# EAGLE schematic sensordrohm (EAGLE 6.2)
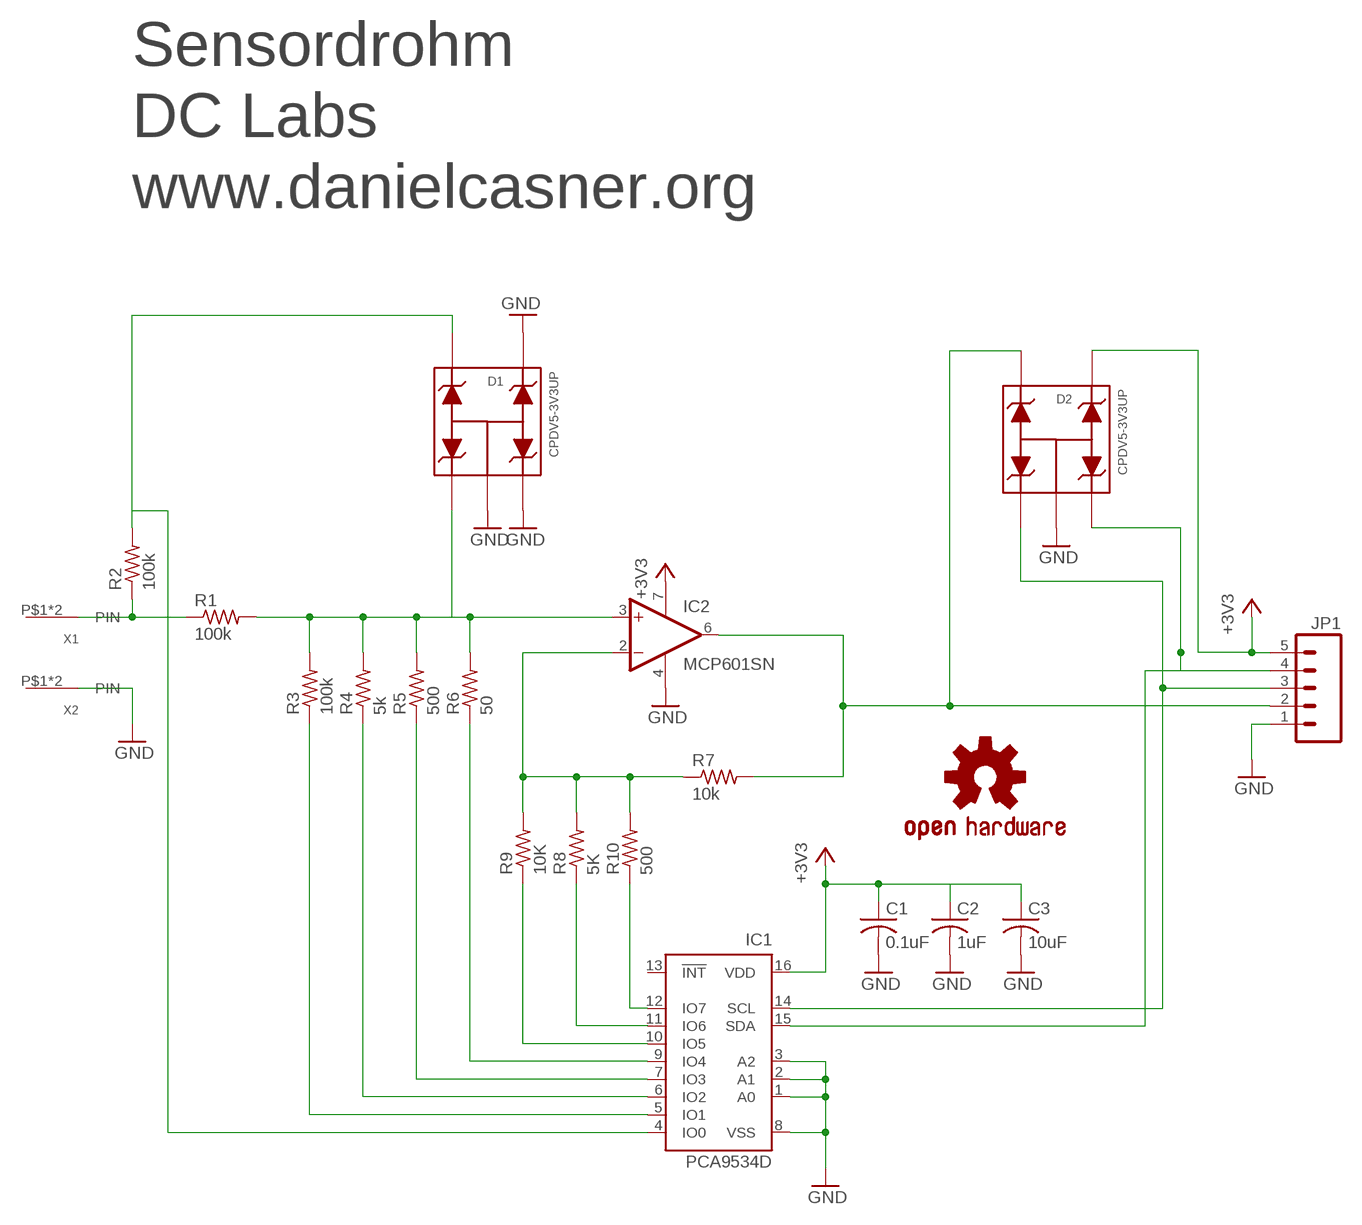
[diagram p0: schematic, sheet 1]

## Parts
C1  0.1uF  C-USC0805  [C0805]
C2  1uF  C-USC0805  [C0805]
C3  10uF  C-USC0805  [C0805]
D1  CPDV5-3V3UP  CPDV5  [SOT353]
D2  CPDV5-3V3UP  CPDV5  [SOT353]
IC1  PCA9534D  [SO16W]
IC2  MCP601SN  [SO08]
JP1  M05PTH_LONGPADS  [1X05_LONGPADS]
R1  100k  R-US_R0402  [R0402]
R2  100k  R-US_R0402  [R0402]
R3  100k  R-US_R0402  [R0402]
R4  5k  R-US_R0402  [R0402]
R5  500  R-US_R0402  [R0402]
R6  50  R-US_R0402  [R0402]
R7  10k  R-US_R0402  [R0402]
R8  5K  R-US_R0402  [R0402]
R9  10K  R-US_R0402  [R0402]
R10  500  R-US_R0402  [R0402]
U$1  OSHW-LOGOS  [OSHW-LOGO-S]
X1  606X  [606X]
X2  606X  [606X]

## Nets
+3V3: C1.1 C2.1 C3.1 D2.4 IC1.16(VDD) IC2.7(V+) JP1.5
GND: C1.2 C2.2 C3.2 D1.2 D1.3 D1.4 D2.2 IC1.1(A0) IC1.2(A1) IC1.3(A2) IC1.8(VSS) IC2.4(V-) JP1.1
N$1: R1.1 R2.1
N$2: D1.1 IC2.3(+IN) R1.2 R3.2 R4.2 R5.2 R6.2
N$3: D2.5 IC2.6(OUT) JP1.2 R7.2
N$4: IC2.2(-IN) R7.1 R8.2 R9.2 R10.2
N$5: D1.5 IC1.4(IO0) R2.2
N$6: IC1.5(IO1) R3.1
N$7: IC1.6(IO2) R4.1
N$8: IC1.7(IO3) R5.1
N$9: IC1.9(IO4) R6.1
N$10: IC1.10(IO5) R9.1
N$11: IC1.11(IO6) R8.1
N$12: D2.3 IC1.15(SDA) JP1.4
N$13: D2.1 IC1.14(SCL) JP1.3
N$14: IC1.12(IO7) R10.1
Unconnected: IC1.13(!INT) X1.P$1(PIN) X1.P$2(PIN) X2.P$1(PIN) X2.P$2(PIN)

## Notes on the sheet
- Sensordrohm
- DC Labs
- www.danielcasner.org

## Library data of the parts
C1-C3 = rcl:C-US: CAPACITOR, American symbol
D1 D2 = DMM:CPDV5: SMD ESD Protection Diode
IC1 = micro-philips:PCA9534: 8-bit I2C-bus and SMBus low power I/O port with interrupt Source: www.nxp.com .. PCA9534_3.pdf; MPN: PCA9534DB; OC_FARNELL: 1408284; OC_NEWARK: 18M7513
IC2 = linear:MCP601: Single Op Amp 2.7V to 6.0V Single Supply CMOS Source: http://ww1.microchip.com/downloads/en/DeviceDoc/21314g.pdf
JP1 = SparkFun-Connectors:M05: Header 5 Standard 5-pin 0.1" header. Use with straight break away headers (SKU : PRT-00116), right angle break away headers (PRT-00553), swiss pins (PRT-00743), machine pins (PRT-00117), and female headers (PRT-00115). Molex polarized connector foot print use with SKU : PRT-08230 with associated crimp pins and housings.
R1-R10 = rcl:R-US_: RESISTOR, American symbol
U$1 = SparkFun-Aesthetics:OSHW-LOGO: Open Source Hardware Logo This logo indicates the piece of hardware it is found on incorporates a OSHW license and/or adheres to the definition of open source hardware found here: http://freedomdefined.org/OSHW
X1 X2 = DMM:606X: 606X seriese Banana Jack